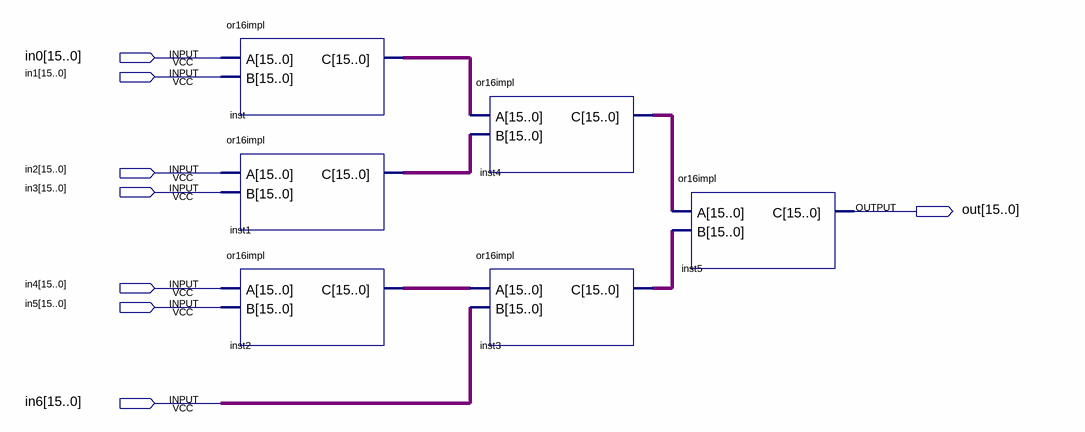
[diagram p0: schematic sheet]
// Quartus schematic 7or16.bdf as structural Verilog: 6 symbols, 8 pins
module \7or16  (
  input  [15:0] in0,
  input  [15:0] in1,
  input  [15:0] in2,
  input  [15:0] in3,
  input  [15:0] in4,
  input  [15:0] in5,
  input  [15:0] in6,
  output [15:0] out
);

  wire [15:0] inst1_c, inst2_c, inst3_c, inst4_c, inst_c;

  or16impl inst (.A(in0), .B(in1), .C(inst_c));
  or16impl inst1 (.A(in2), .B(in3), .C(inst1_c));
  or16impl inst2 (.A(in4), .B(in5), .C(inst2_c));
  or16impl inst4 (.A(inst_c), .B(inst1_c), .C(inst4_c));
  or16impl inst3 (.A(inst2_c), .B(in6), .C(inst3_c));
  or16impl inst5 (.A(inst4_c), .B(inst3_c), .C(out));
endmodule
